# Altium schematic sheet DE-080324.SchDoc: Addressable RFID
size A4; Author: eldar6776@hotmail.com; DrawnBy: Eldar Dedić; Organization: JUBERA d.o.o.; Address1: Braće Mulić 81; Address2: 71000 Sarajevo; Address3: Federacija BiH; Address4: Bosna i Hercegovina; DocumentNumber: 1; Revision: 001; SheetNumber: 1; SheetTotal: 1; ProjectName: DE-080324
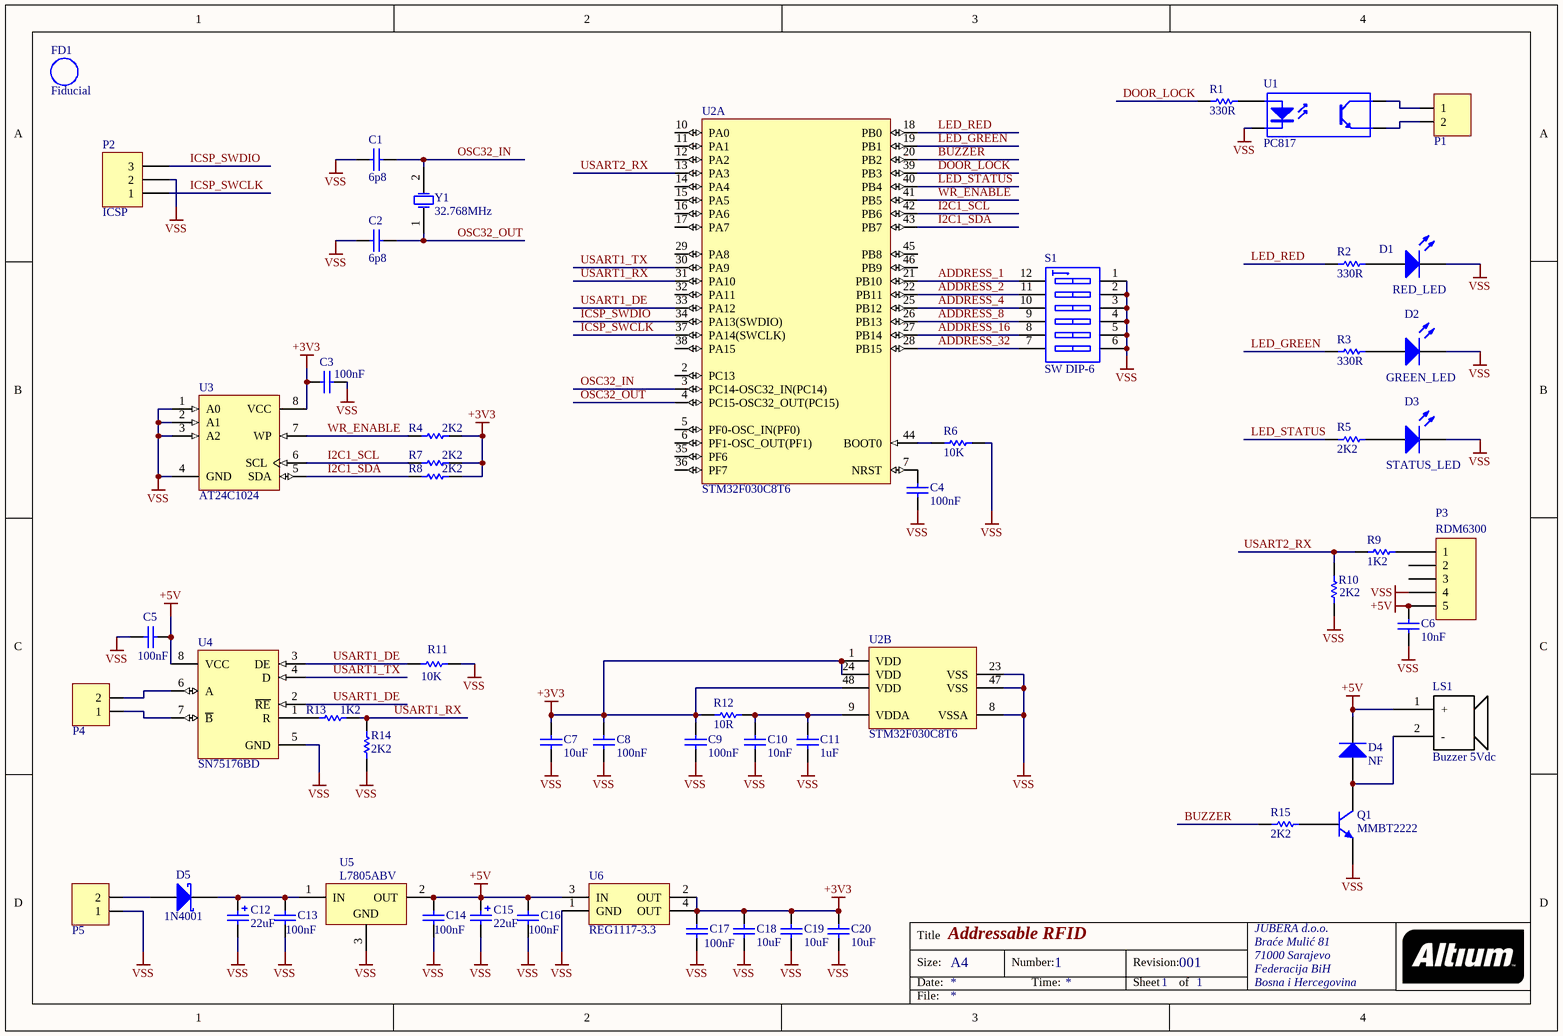
[diagram p0: DE-080324.SchDoc]

## Parts
C1  6p8  [0603]
C2  6p8  [0603]
C3  100nF  [0603]
C4  100nF  [0603]
C5  100nF  [0603]
C6  10nF  [0603]
C7  10uF  [0805]
C8  100nF  [0603]
C9  100nF  [0603]
C10  10nF  [0603]
C11  1uF  [0603]
C12  22uF  [CAPPR2-5X11]
C13  100nF  [0603]
C14  100nF  [0603]
C15  22uF  [CAPPR2-5X11]
C16  100nF  [0603]
C17  100nF  [0603]
C18  10uF  [0805]
C19  10uF  [0805]
C20  10uF  [0805]
D1  RED_LED  [2.0X1.25X1.2]
D2  GREEN_LED  [2.0X1.25X1.2]
D3  STATUS_LED  [2.0X1.25X1.2]
D4  NF  [SOD323]
D5  1N4001  [SMB]
FD1  Fiducial  [Fiducial]  (no BOM)
LS1  Buzzer 5Vdc  [BUZZER]
P1  TERMINAL BLOK 2  [TERMINAL BLOK 2]  (value not drawn)
P2  ICSP  [HDR1X3]
P3  RDM6300  [HDR1X5]
P4  TERMINAL BLOK 2  [TERMINAL BLOK 2]  (value not drawn)
P5  TERMINAL BLOK 2  [TERMINAL BLOK 2]  (value not drawn)
Q1  MMBT2222  [SOT23_N]
R1  330R  [ERA-0603]
R2  330R  [ERA-0603]
R3  330R  [ERA-0603]
R4  2K2  [ERA-0603]
R5  2K2  [ERA-0603]
R6  10K  [ERA-0603]
R7  2K2  [ERA-0603]
R8  2K2  [ERA-0603]
R9  1K2  [ERA-0603]
R10  2K2  [ERA-0603]
R11  10K  [ERA-0603]
R12  10R  [ERA-0603]
R13  1K2  [ERA-0603]
R14  2K2  [ERA-0603]
R15  2K2  [ERA-0603]
S1  SW DIP-6  [DIP-12/SW]
U1  PC817  [SOP4]
U2  STM32F030C8T6  [STM-LQFP48_N]  (parts A,B of 2)
U3  AT24C1024  [8A2_L]
U4  SN75176BD  [D008_L]
U5  L7805ABV  [TO220ABN]
U6  REG1117-3.3  [ZZ311]
Y1  32.768MHz  [R26]

## Nets
+3V3: C3.1 C7.2 C8.2 C9.2 C17.2 C18.2 C19.2 C20.2 R4.2 R7.2 R8.2 R12.1 U2.1(VDD) U2.24(VDD) U2.48(VDD) U3.8(VCC) U6.2(OUT) U6.4(OUT)
+5V: C5.2 C6.2 C14.2 C15.1 C16.2 D4.1(K) LS1.1(+) P3.5 U4.8(VCC) U5.2(OUT) U6.3(IN)
VSS: C1.2 C2.2 C3.2 C4.1 C5.1 C6.1 C7.1 C8.1 C9.1 C10.1 C11.1 C12.2 C13.1 C14.1 C15.2 C16.1 C17.1 C18.1 C19.1 C20.1 D1.2(K) D2.2(K) D3.2(K) P2.2 P3.4 P5.1 Q1.2(E) R6.2 R10.1 R11.2 R14.1 S1.1(A1) S1.2(A2) S1.3(A3) S1.4(A4) S1.5(A5) S1.6(A6) U1.2(K) U2.8(VSSA) U2.23(VSS) U2.47(VSS) U3.1(A0) U3.2(A1) U3.3(A2) U3.4(GND) U4.5(GND) U5.3(GND) U6.1(GND)
ADDRESS_1: S1.12(B1) U2.21(PB10)
ADDRESS_2: S1.11(B2) U2.22(PB11)
ADDRESS_4: S1.10(B3) U2.25(PB12)
ADDRESS_8: S1.9(B4) U2.26(PB13)
ADDRESS_16: S1.8(B5) U2.27(PB14)
ADDRESS_32: S1.7(B6) U2.28(PB15)
BUZZER: R15.1 U2.20(PB2)
DOOR_LOCK: R1.1 U2.39(PB3)
I2C1_SCL: R7.1 U2.42(PB6) U3.6(SCL)
I2C1_SDA: R8.1 U2.43(PB7) U3.5(SDA)
ICSP_SWCLK: P2.1 U2.37(PA14(SWCLK))
ICSP_SWDIO: P2.3 U2.34(PA13(SWDIO))
LED_GREEN: R3.1 U2.19(PB1)
LED_RED: R2.1 U2.18(PB0)
LED_STATUS: R5.1 U2.40(PB4)
OSC32_IN: C1.1 U2.3(PC14-OSC32_IN(PC14)) Y1.2(OSC2)
OSC32_OUT: C2.1 U2.4(PC15-OSC32_OUT(PC15)) Y1.1(OSC1)
USART1_DE: R11.1 U2.33(PA12) U4.2(~{RE}) U4.3(DE)
USART1_RX: R13.2 R14.2 U2.31(PA10)
USART1_TX: U2.30(PA9) U4.4(D)
USART2_RX: R9.1 R10.2 U2.13(PA3)
WR_ENABLE: R4.1 U2.41(PB5) U3.7(WP)
NetC4_2: C4.2 U2.7(NRST)
NetC10_2: C10.2 C11.2 R12.2 U2.9(VDDA)
NetC12_1: C12.1 C13.2 D5.2(K) U5.1(IN)
NetD1_1: D1.1(A) R2.2
NetD2_1: D2.1(A) R3.2
NetD3_1: D3.1(A) R5.2
NetD4_2: D4.2(A) LS1.2(-) Q1.3(C)
NetD5_1: D5.1(A) P5.2
NetP1_1: P1.1 U1.4(C)
NetP1_2: P1.2 U1.3(E)
NetP3_1: P3.1 R9.2
NetP4_1: P4.1 U4.7(~{B})
NetP4_2: P4.2 U4.6(A)
NetQ1_1: Q1.1(B) R15.2
NetR1_2: R1.2 U1.1(A)
NetR6_1: R6.1 U2.44(BOOT0)
NetR13_1: R13.1 U4.1(R)

Not connected (* = marked no-connect by the designer): P3 2 3; U2 2(PC13) 5(PF0-OSC_IN(PF0)) 6(PF1-OSC_OUT(PF1)) 10(PA0) 11(PA1) 12(PA2) 14(PA4) 15(PA5) 16(PA6) 17(PA7) 29(PA8) 32(PA11) 35(PF6) 36(PF7) 38(PA15) 45(PB8) 46(PB9)

## Notes on the sheet
- Title
- Size:
- Date:
- A4
- Number:
- Time:
- Revision:
- Sheet
- of
- File:

## Library data of the parts
C1-C6 C8-C11 C13 C14 C16 C17 = C0603: Ceramic Chip Capacitor - Standard; Note: Footprint corresponds to dimensions for bulk cassette packaging. This case size has tightened tolerances.; Published: 17-Jul-2002; LatestRevisionDate: 19-Mar-2004; LatestRevisionNote: Silkscreen size reduced.; DatasheetDocument: Mar-2001; PackageDocument: Mar-2001; PackageReference: 0603; Publisher: Altium Limited; Code_JEITA: 0603; Code_IPC: 1608 [0603]; ComponentLink1Description: Manufacturer Link; ComponentLink1URL: http://www.kemet.com/; ComponentLink2Description: Datasheet; ComponentLink2URL: http://www.kemet.com/kemet/web/homepage/kechome.nsf/vapubfilesname/F3102TA.pdf/$file/F3102TA.pdf
C7 C18-C20 = C0805: Ceramic Chip Capacitor - Standard; Note: Footprint corresponds to dimensions for bulk cassette packaging. This case size has tightened tolerances.; Published: 17-Jul-2002; LatestRevisionDate: 19-Mar-2004; LatestRevisionNote: Silkscreen size reduced.; DatasheetDocument: Mar-2001; PackageDocument: Mar-2001; PackageReference: 0805; Publisher: Altium Limited; Code_JEITA: 0805; Code_IPC: 2012[0805]; ComponentLink1Description: Manufacturer Link; ComponentLink1URL: http://www.kemet.com/; ComponentLink2Description: Datasheet; ComponentLink2URL: http://www.kemet.com/kemet/web/homepage/kechome.nsf/vapubfilesname/F3102TA.pdf/$file/F3102TA.pdf
C12 C15 = EKA00AA247F00: Aluminum Electrolytic Capacitor, Radial Style with Long Leads: 47uF, 35V; Note: Refer to Manufacturer's Data Sheets for other lead formations; DrillSize: Nominal, Rounded To The Nearest 0.1mm; Published: 19-Mar-2004; DatasheetDocument: 20-Feb-2001; PackageReference: CAPPR2-5X11; Publisher: Altium Limited; ComponentLink1Description: Manufacturer Link; ComponentLink1URL: http://www.vishay.com/; ComponentLink2Description: Datasheet; ComponentLink2URL: http://www.vishay.com/docs/25014/eka.pdf; Value: 47uF
D1-D3 = HSMC-C540-F0001: Top Mount AS AlInGaP Red Oval Lens High Brightness; LuminousIntensity: 96mcd (Minimum).; PCB_Layout: Complies with manufacturer's recommendation.; Published: 11-Dec-2002; DatasheetDocument: 7-Mar-2002; PackageDocument: 30-Apr-2002; PackageReference: 2.0X1.25X1.2; Publisher: Altium Limited; LED_Colour: Red; ComponentLink1Description: Manufacturer Link; ComponentLink1URL: http://www.agilent.com/; ComponentLink2Description: Datasheet; ComponentLink2URL: http://cp.literature.agilent.com/litweb/pdf/5988-5794EN.pdf
D4 = BAS321: General-purpose Diode; Published: 17-Sep-2003; LatestRevisionDate: 19-Mar-2004; LatestRevisionNote: Silkscreen size reduced.; DatasheetVersion: 9-Feb-1999; PackageVersion: May-1999; PackageReference: SOD323; Publisher: Altium Limited; PackageDescription: SOD-323/SC-76; 2 Leads; Body 1.7 x 1.3 mm, (LxW); ComponentLink1Description: Manufacturer Link; ComponentLink1URL: http://www.semiconductors.philips.com/; ComponentLink2Description: Datasheet; ComponentLink2URL: http://www.semiconductors.philips.com/acrobat/datasheets/BAS321_2.pdf
D5 = 10BQ100: Schottky Rectifier; Published: 8-Jun-2000; LatestRevisionDate: 17-Jul-2002; LatestRevisionNote: Re-released for DXP Platform.; DatasheetVersion: PD-2.437A; PackageReference: SMB; Publisher: Altium Limited; PackageDescription: DO-214-AA/SMB; 2 C-Bend Leads; Body 5.3 x 3.6 mm, inc. leads (LxW); ComponentLink1Description: Manufacturer Link; ComponentLink1URL: http://www.irf.com/; ComponentLink2Description: Datasheet; ComponentLink2URL: http://www.irf.com/product-info/datasheets/data/10bq100.pdf
FD1 = Fiduchial: Fiduchial mark
LS1 = BUZZER: 5Vdc PCB buzzer
P1 P4 P5 = TERMINAL BLOK 2: 2 pinski terminal blok
P2 = Header 3: Header, 3-Pin; LatestRevisionDate: 17-Jul-2002; LatestRevisionNote: Re-released for DXP Platform.; Publisher: Altium Limited
P3 = Header 5: Header, 5-Pin; LatestRevisionDate: 17-Jul-2002; LatestRevisionNote: Re-released for DXP Platform.; Publisher: Altium Limited
Q1 = BC817: NPN General-purpose Transistor; Published: 17-Sep-2003; LatestRevisionDate: 12-Dec-2006; LatestRevisionNote: IPC-7351 Footprint Added.; DatasheetVersion: Jun-1999; PackageVersion: May-1999; PackageReference: SOT23; Publisher: Altium Limited; PackageDescription: 3-Pin SOT-23 Package 0.95 mm Pitch, 2.3 mm Lead Span; ComponentLink1Description: Manufacturer Link; ComponentLink1URL: http://www.semiconductors.philips.com/; ComponentLink2Description: Datasheet; ComponentLink2URL: http://www.semiconductors.philips.com/acrobat/datasheets/BC817_BC817W_BC337_5.pdf
R1-R15 = ERAV: Metal Film Thermosensitive Chip Resistor, 0.56 Ohm to 10k Ohm Range, 5% Tolerance, 0603 Size, 0.063 W; Note: If flow soldering, adjust pad width of PCB Footprint to 0.7 - 0.8 times the width of the resistor.; Published: 17-Dec-2003; LatestRevisionDate: 19-Mar-2004; LatestRevisionNote: Silkscreen size reduced.; PackageDocument: Mar-2003; PackageReference: ERA-0603; Publisher: Altium Limited; Code_IPC: 1608 [0603]; ComponentLink1Description: Manufacturer Link; ComponentLink1URL: http://www.panasonic.com/industrial/components/resistive_products.htm; ComponentLink2Description: Datasheet; ComponentLink2URL: http://www.panasonic.com/industrial/components/pdf/AOF0000CE1.pdf
S1 = SW DIP-6: DIP Switch, 6 Position, SPST; Published: 24-Mar-1999; LatestRevisionDate: 17-Jul-2002; LatestRevisionNote: Re-released for DXP Platform.; PackageReference: DIP-12/SW; Publisher: Altium Limited; PackageDescription: DIP Switch; 12 Leads
U1 = PC817 optocoupler: 4-Pin Phototransistor Optocoupler; Published: 24-Mar-1999; LatestRevisionDate: 04-Mar-2005; LatestRevisionNote: Sch pins 3 & 4 Swapped.; DatasheetVersion: Nov-2003; PackageReference: DIP-4; Publisher: Altium Limited
U2 = STM32F030C8T6: ARM Cortex-M0 32-bit MCU, 64 KB Flash, 8 KB Internal RAM, 39 I/Os, 48-pin LQFP, -40 to 85 degC, Tray; FLASH Size (Prog) (kB): 64; I/Os (High Current): 39; Internal RAM Size (kB): 8; Operating Frequency(F) (Processor speed) (MHz): 48; Supply Voltage(Vcc) min (V): 2.4; DatasheetVersion: Rev. 1; PackageVersion: Rev. 6, 06/2013; PackageReference: LQFP48; PackageDescription: 48-Pin Low Profile Quad Flat Package, 7 x 7 mm Body, 0.5 mm Pitch; Supplier 1: Digi-Key; Supplier Part Number 1: 497-14043-ND; Supplier 2: Newark; Supplier Part Number 2: 06X3647; Supplier 3: Mouser; Supplier Part Number 3: 511-STM32F030C8T6; Core: ARM Cortex-M0; Packing: Tray; Mounting Technology: Surface Mount; PartNumber: STM32F030C8T6; ComponentLink1Description: Manufacturer URL; ComponentLink1URL: http://www.st.com/web/en/home.html; ComponentLink2Description: Datasheet; ComponentLink2URL: http://www.st.com/st-web-ui/static/active/en/resource/technical/document/datasheet/DM00088500.pdf; ComponentLink3Description: Package Specification; ComponentLink3URL: http://www.st.com/st-web-ui/static/active/en/resource/technical/document/datasheet/DM00058181.pdf
U3 = AT24C02B-TP25-T: 2Kbit (256 x 8), 2-wire Bus Automotive Serial EEPROM with full memory Write Protect, 2.5V, 8-Pin TSSOP, Tape & Reel; Published: 20-Sep-2010; DatasheetVersion: 8517C,  Jan-2009; PackageVersion: revD, Dec-2009; PackageReference: 8A2; Publisher: Altium Limited; PackageDescription: 8-Lead, 4.4 mm Body, Plastic Thin Shrink Small Outline Package (TSSOP); Code_JEDEC: MO-153-AA; ComponentLink1Description: Manufacturer Link; ComponentLink1URL: http://www.atmel.com/products/serial/default.asp; ComponentLink2Description: Datasheet; ComponentLink2URL: http://www.atmel.com/dyn/resources/prod_documents/doc8517.pdf; ComponentLink3Description: Atmel.com Home; ComponentLink3URL: http://www.atmel.com
U4 = SN75176BD: Differential Bus Transceiver; Note: Receiver Hysteresis of 50mV Typical; Published: 15-May-2002; LatestRevisionDate: 13-Apr-2006; LatestRevisionNote: IPC-7351 Footprint Added.; DatasheetVersion: Sep-1989; PackageVersion: Jan-1998; PackageReference: D008; Publisher: Altium Limited; PackageDescription: 8-Pin Small Outline Integrated Circuit 1.27 mm Pitch; Code_IPC: SOIC127P600-8; ComponentLink1Description: Manufacturer Link; ComponentLink1URL: http://www.ti.com/; ComponentLink2Description: Datasheet; ComponentLink2URL: http://www-s.ti.com/sc/ds/sn75176b.pdf
U5 = L7805ABV: Precision 1A Regulator; Note: Tab is connected to pin 3 (GND).; Published: 24-Aug-2001; LatestRevisionDate: 17-Jul-2002; LatestRevisionNote: Re-released for DXP Platform.; DatasheetVersion: Nov-1999; PackageVersion: Jun-1998; PackageReference: TO220ABN; Publisher: Altium Limited; PackageDescription: TO, Thru-Hole, Vertical, Heatsink Mounted; 3 In-Line Leads; Pitch 2.54 mm; Pin sequence 1, 3, 2; ComponentLink1Description: Manufacturer Link; ComponentLink1URL: http://www.st.com/; ComponentLink2Description: Datasheet; ComponentLink2URL: http://www.st.com/stonline/products/literature/ds/2144/l7805ab.pdf
U6 = REG1117-3.3: 800mA and 1A Low Dropout Positive Regulator 2.85V, 3.3V, 5V, and Adjustable; Published: 8-Jun-2000; LatestRevisionDate: 17-Jul-2002; LatestRevisionNote: Re-released for DXP Platform.; DatasheetVersion: Sep-1997; PackageVersion: revC; PackageReference: ZZ311; Publisher: Altium Limited; PackageDescription: SOT-223/SC-73; 4 Leads; Body 6.7 x 7.3 mm, inc. leads (LxW max); ComponentLink1Description: Manufacturer Link; ComponentLink1URL: http://www.ti.com/; ComponentLink2Description: Datasheet; ComponentLink2URL: http://www-s.ti.com/sc/ds/REG1117.pdf
Y1 = R26-32.768: Tuning Fork Crystal Unit; Published: 8-Jun-2000; LatestRevisionDate: 17-Jul-2002; LatestRevisionNote: Re-released for DXP Platform.; DatasheetDocument: 28-Sep-1998; PackageReference: R26; Publisher: Altium Limited; ComponentLink1Description: Manufacturer Link; ComponentLink1URL: http://www.raltron.com/products/microcrystals/default.asp; ComponentLink2Description: Datasheet; ComponentLink2URL: http://www.raltron.com/products/pdfspecs/crystal_r38_26_145.pdf